# Altium project QS30.PrjPcb
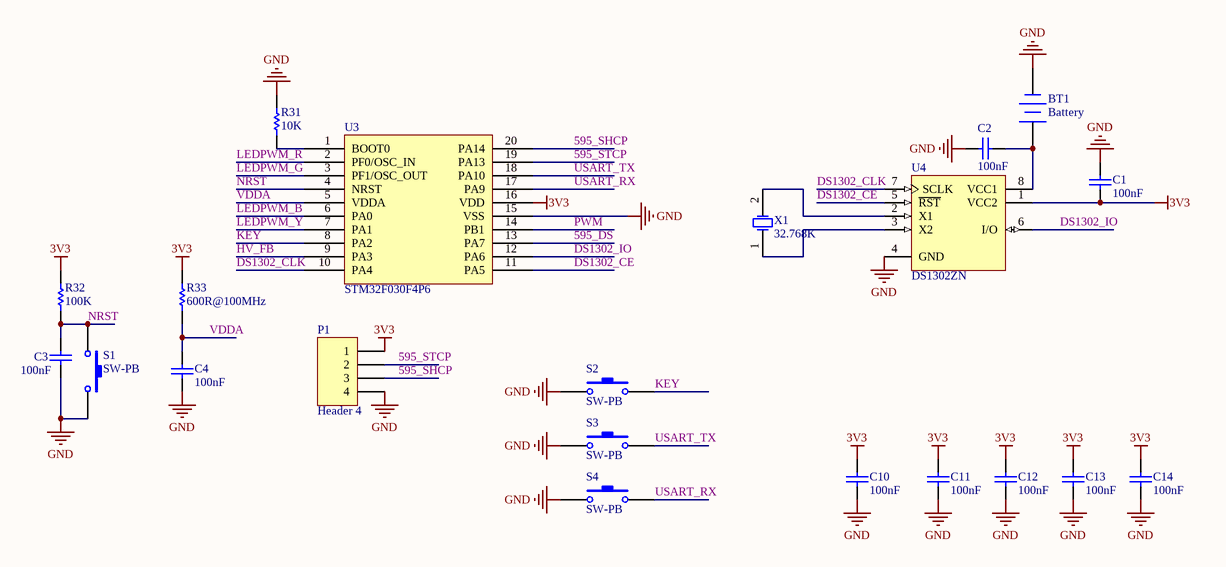
[diagram p0: QS30-MCU.SchDoc]
1 sheet, 21 parts. Net scope: global (net labels, ports and power ports of the same name join across sheets).
Board file: QS30.PcbDoc

## Sheet QS30-MCU.SchDoc
size A4

### Parts
BT1  Battery  [BAT]
C1  value 100nF  [6-0805_N]  (hidden comment: Cap)
C2  value 100nF  [6-0805_N]  (hidden comment: Cap)
C3  100nF  [6-0805_N]
C4  value 100nF  [6-0805_N]  (hidden comment: Cap)
C10  value 100nF  [C1210]  (hidden comment: Cap)
C11  value 100nF  [6-0805_N]  (hidden comment: Cap)
C12  value 100nF  [6-0805_N]  (hidden comment: Cap)
C13  value 100nF  [6-0805_N]  (hidden comment: Cap)
C14  value 100nF  [6-0805_N]  (hidden comment: Cap)
P1  Header 4  [SWD_DOWNLOAD]
R31  value 10K  [1608[0603]]  (hidden comment: Res1)
R32  100K  [6-0805_N]
R33  value 600R@100MHz  [6-0805_N]
S1  SW-PB  [aj3X6]
S2  SW-PB  [aj3X6]
S3  SW-PB  [aj3X6]
S4  SW-PB  [aj3X6]
U3  STM32F030F4P6  [TSSOP20_N]
U4  DS1302ZN  [SOIC8N_N]
X1  32.768K  [MC306]

### Nets
3V3: C1.1 C10.2 C11.2 C12.2 C13.2 C14.2 P1.1 R32.2 R33.1 U3.16(VDD) U4.1(VCC2)
GND: BT1.2(-) C1.2 C2.2 C3.1 C4.1 C10.1 C11.1 C12.1 C13.1 C14.1 P1.4 R31.2 S1.2 S2.1 S3.1 S4.1 U3.15(VSS) U4.4(GND)
595_DS: U3.13(PA7)
595_SHCP: P1.3 U3.20(PA14)
595_STCP: P1.2 U3.19(PA13)
DS1302_CE: U3.11(PA5) U4.5(~{RST})
DS1302_CLK: U3.10(PA4) U4.7(SCLK)
DS1302_IO: U3.12(PA6) U4.6(I/O)
HV_FB: U3.9(PA3)
KEY: S2.2 U3.8(PA2)
LEDPWM_B: U3.6(PA0)
LEDPWM_G: U3.3(PF1/OSC_OUT)
LEDPWM_R: U3.2(PF0/OSC_IN)
LEDPWM_Y: U3.7(PA1)
NRST: C3.2 R32.1 S1.1 U3.4(NRST)
PWM: U3.14(PB1)
USART_RX: S4.2 U3.17(PA9)
USART_TX: S3.2 U3.18(PA10)
VDDA: C4.2 R33.2 U3.5(VDDA)
NetBT1_1: BT1.1(+) C2.1 U4.8(VCC1)
NetR31_1: R31.1 U3.1(BOOT0)
NetU4_2: U4.2(X1) X1.2(OSC2)
NetU4_3: U4.3(X2) X1.1(OSC1)

### Library data of the parts
BT1 = Battery: Multicell Battery; Published: 24-Mar-1999; LatestRevisionDate: 17-Jul-2002; LatestRevisionNote: Re-released for DXP Platform.; PackageReference: BAT-2; Publisher: Altium Limited; PackageDescription: Battery; 2 Leads
C1 C2 C4 C10-C14 = Cap: Capacitor; Published: 8-Jun-2000; LatestRevisionDate: 17-Jul-2002; LatestRevisionNote: Re-released for DXP Platform.; PackageReference: RAD-0.3; Publisher: Altium Limited; PackageDescription: Radial Cap, Thru-Hole; 2 Leads; 0.3 in Pin Spacing
C3 = CAP: Capacitor; Published: 8-Jun-2000; Revision: July-2002: Re-released for DXP Platform.; Publisher: Altium Limited; Value: 100nF
P1 = Header 4: Header, 4-Pin; LatestRevisionDate: 17-Jul-2002; LatestRevisionNote: Re-released for DXP Platform.; Publisher: Altium Limited
R31 R33 = Res1: Resistor; Published: 8-Jun-2000; LatestRevisionDate: 17-Jul-2002; LatestRevisionNote: Re-released for DXP Platform.; PackageReference: AXIAL-0.3; Publisher: Altium Limited; PackageDescription: Axial Device, Thru-Hole; 2 Leads; 0.3 in Pin Spacing
R32 = res1: Resistor; Fitted: NO; Published: 8-Jun-2000; Revision: July-2002: Re-released for DXP Platform.; Publisher: Altium Limited; Value: 100K
S1-S4 = SW-PB: Switch; Published: 24-Mar-1999; LatestRevisionDate: 17-Jul-2002; LatestRevisionNote: Re-released for DXP Platform.; PackageReference: SPST-2; Publisher: Altium Limited; PackageDescription: Switch; 2 Leads
U4 = DS1302ZN: Trickle Charge Timekeeping Chip; Published: 13-Oct-2000; LatestRevisionDate: 13-Apr-2006; LatestRevisionNote: IPC-7351 Footprint Added.; DatasheetVersion: 2-Jul-1999; PackageVersion: 1999; PackageReference: SOIC8N; Publisher: Altium Limited; PackageDescription: 8-Pin Small Outline Integrated Circuit 1.27 mm Pitch; Code_IPC: SOIC127P600-8; ComponentLink1Description: Manufacturer Link; ComponentLink1URL: http://www.maxim-ic.com/; ComponentLink2Description: Datasheet; ComponentLink2URL: http://pdfserv.maxim-ic.com/en/ds/DS1302.pdf; ComponentLink3Description: Discontinuation Notice; ComponentLink3URL: http://www.maxim-ic.com/qa/pdfs/non-obsolescence-letter.pdf
X1 = XTAL: Crystal Oscillator; pin to pad: 2>4; Published: 8-Jun-2000; LatestRevisionDate: 17-Jul-2002; LatestRevisionNote: Re-released for DXP Platform.; PackageReference: R38; Publisher: Altium Limited; PackageDescription: Crystal, Thru-Hole; 2 Leads; Body 3.1 x 8.2 mm (Dia.xH)